# EAGLE design Circuit (EAGLE 9.6.2)
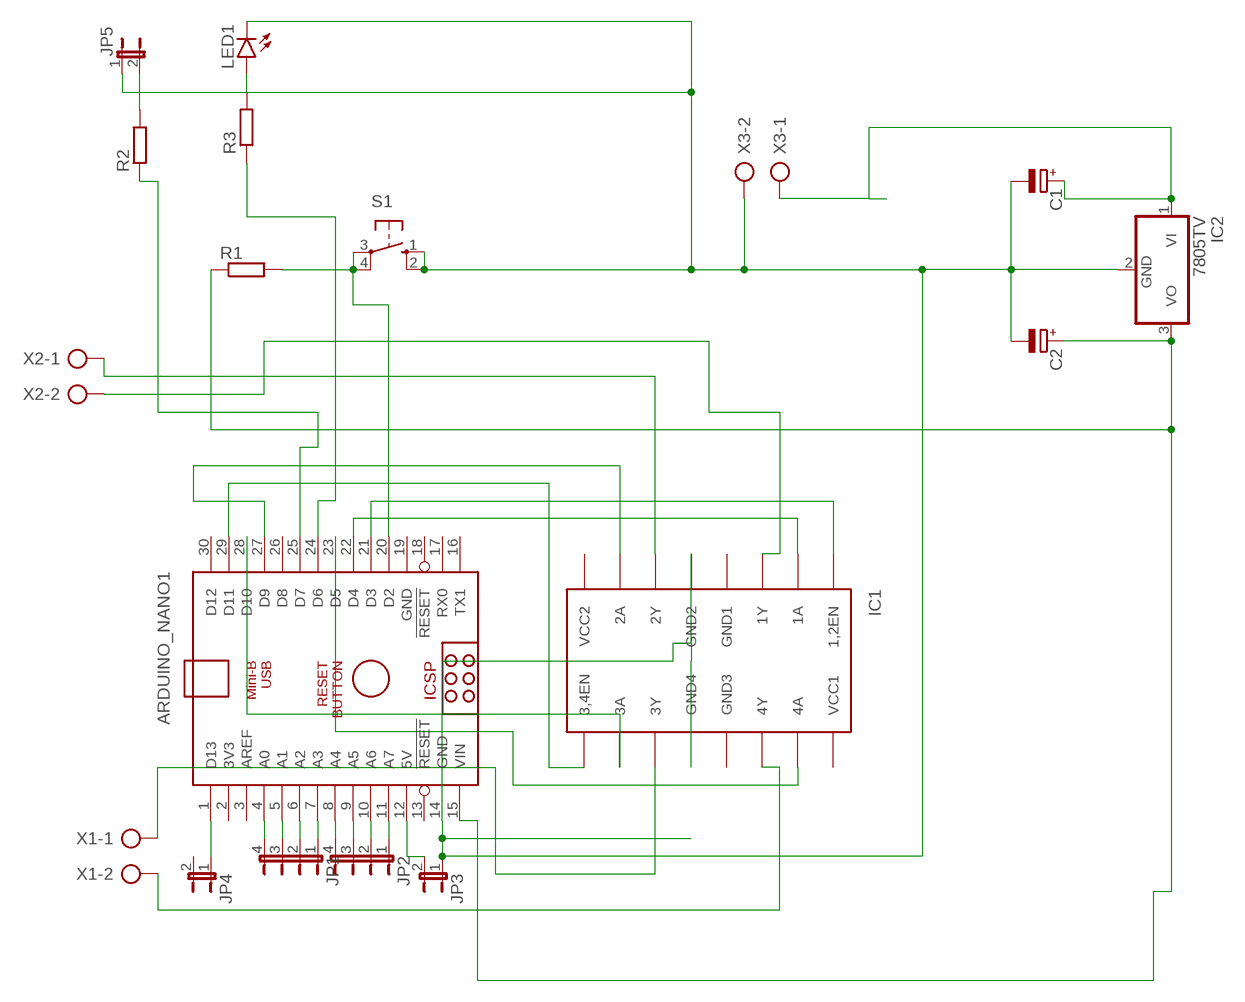
[diagram p0: schematic, sheet 1]

## Parts
ARDUINO_NANO1  ARDUINO_NANO  [ARDUINO_NANO]
C1  CPOL-EUE2.5-6  [E2,5-6]
C2  CPOL-EUE2.5-6  [E2,5-6]
IC1  L293D  [DIL16]
IC2  7805TV  [TO220V]
JP1  JP4E  [JP4]
JP2  JP4E  [JP4]
JP3  JP1E  [JP1]
JP4  JP1E  [JP1]
JP5  JP1E  [JP1]
LED1  LED5MM  [LED5MM]
R1  R-EU_0207/12  [0207/12]
R2  R-EU_0207/12  [0207/12]
R3  R-EU_0207/12  [0207/12]
S1  10-XX  [B3F-10XX]
X1  AK500/2  [AK500/2]
X2  AK500/2  [AK500/2]
X3  AK500/2  [AK500/2]

## Nets
N$1: ARDUINO_NANO1.4(A0) JP1.4
N$2: ARDUINO_NANO1.5(A1) JP1.3
N$3: ARDUINO_NANO1.6(A2) JP1.2
N$4: ARDUINO_NANO1.7(A3) JP1.1
N$5: ARDUINO_NANO1.8(A4) JP2.4
N$6: ARDUINO_NANO1.9(A5) JP2.3
N$7: ARDUINO_NANO1.10(A6) JP2.2
N$8: ARDUINO_NANO1.11(A7) JP2.1
N$9: ARDUINO_NANO1.12(5V) JP3.2
N$10: ARDUINO_NANO1.24(D6) R3.1
N$11: ARDUINO_NANO1.1(D13) JP4.1
N$12: ARDUINO_NANO1.21(D3) IC1.1(1,2EN)
N$13: ARDUINO_NANO1.22(D4) IC1.2(1A)
N$14: ARDUINO_NANO1.27(D9) IC1.7(2A)
N$15: ARDUINO_NANO1.29(D11) IC1.9(3,4EN)
N$16: ARDUINO_NANO1.23(D5) IC1.15(4A)
N$17: ARDUINO_NANO1.28(D10) IC1.10(3A)
N$18: IC1.11(3Y) X1.1
N$19: IC1.14(4Y) X1.2
N$20: IC1.6(2Y) X2.1
N$21: IC1.3(1Y) X2.2
N$22: C1.+ IC2.1(VI) X3.1
N$23: ARDUINO_NANO1.15(VIN) C2.+ IC2.3(VO) R1.1
N$24: ARDUINO_NANO1.14(GND) C1.- C2.- IC1.5(GND2) IC1.12(GND4) IC2.2(GND) JP3.1 JP5.1 LED1.K(C) S1.1(S) S1.2(S1) X3.2
N$25: ARDUINO_NANO1.20(D2) R1.2 S1.3(P) S1.4(P1)
N$26: LED1.A R3.2
N$27: ARDUINO_NANO1.25(D7) R2.1
N$28: JP5.2 R2.2
Unconnected: ARDUINO_NANO1.2(3V3) ARDUINO_NANO1.3(AREF) ARDUINO_NANO1.13(!RESET) ARDUINO_NANO1.16(TX1) ARDUINO_NANO1.17(RX0) ARDUINO_NANO1.18(!RESET) ARDUINO_NANO1.26(D8) ARDUINO_NANO1.30(D12) JP4.2

## Power pins joined to a net without a drawn wire
GND: ARDUINO_NANO1.19(GND)
GND1: IC1.4(GND1)
GND3: IC1.13(GND3)
VCC1: IC1.16(VCC1)
VCC2: IC1.8(VCC2)

## Library data of the parts
ARDUINO_NANO1 = ArduinoNanoV30:ARDUINO_NANO: Arduino Nano V3.0 Overview: The Arduino Nano is a small, complete, and breadboard-friendly board based on the ATmega328 (Arduino Nano 3.x) or ATmega168 (Arduino Nano 2.x). It has more or less the same functionality of the Arduino Duemilanove, but in a different package. It lacks only a DC power jack, and works with a Mini-B USB cable instead of a standard one. The Nano was designed and is being produced by Gravitech. Specifications: Microcontroller Atmel ATmega168 or ATmega328 Operating Voltage (logic level) 5 V Input Voltage (recommended) 7-12 V Input Voltage (limits) 6-20 V Digital I/O Pins 14 (of which 6 provide PWM output) Analog Input Pins 8 DC Current per I/O Pin 40 mA Flash Memory 16 KB (ATmega168) or 32 KB (ATmega328) of which 2 KB used by bootloader SRAM 1 KB (ATmega168) or 2 KB (ATmega328) EEPROM 512 bytes (ATmega168) or 1 KB (ATmega328) Clock Speed 16 MHz Dimensions 0.73" x 1.70" Length 45 mm Width 18 mm Weigth 5 g Power: The Arduino Nano can be powered via the Mini-B USB connection, 6-20V unregulated external power supply (pin 30), or 5V regulated external power supply (pin 27). The power source is automatically selected to the highest voltage source. Memory: The ATmega168 has 16 KB of flash memory for storing code (of which 2 KB is used for the bootloader); the ATmega328 has 32 KB, (also with 2 KB used for the bootloader). The ATmega168 has 1 KB of SRAM and 512 bytes of EEPROM (which can be read and written with the EEPROM library); the ATmega328 has 2 KB of SRAM and 1 KB of EEPROM. Input and Output: Each of the 14 digital pins on the Nano can be used as an input or output, using pinMode(), digitalWrite(), and digitalRead() functions. They operate at 5 volts. Each pin can provide or receive a maximum of 40 mA and has an internal pull-up resistor (disconnected by default) of 20-50 kOhms. In addition, some pins have specialized functions. Visit Arduino - ArduinoBoardNano <https://www.arduino.cc/en/Main/ArduinoBoardNano>
C1 C2 = rcl:CPOL-EU: POLARIZED CAPACITOR, European symbol; SPICEPREFIX: C
IC1 = sgs-thom:L293D
IC2 = linear:78*: Positive VOLTAGE REGULATOR Source: http://cache.national.com/ds/LM/LM78L05.pdf http://www.fairchildsemi.com/ds/LM/LM7805.pdf
JP1 JP2 = jumper:JP4E: JUMPER
JP3-JP5 = jumper:JP1E: JUMPER
LED1 = led:LED: LED OSRAM: - CHIPLED LG R971, LG N971, LY N971, LG Q971, LY Q971, LO R971, LY R971 LH N974, LH R974 LS Q976, LO Q976, LY Q976 LO Q996 - Hyper CHIPLED LW Q18S LB Q993, LB Q99A, LB R99A - SideLED LS A670, LO A670, LY A670, LG A670, LP A670 LB A673, LV A673, LT A673, LW A673 LH A674 LY A675 LS A676, LA A676, LO A676, LY A676, LW A676 LS A679, LY A679, LG A679 - Hyper Micro SIDELED® LS Y876, LA Y876, LO Y876, LY Y876 LT Y87S - SmartLED LW L88C, LW L88S LB L89C, LB L89S, LG L890 LS L89K, LO L89K, LY L89K LS L896, LA L896, LO L896, LY L896 - TOPLED LS T670, LO T670, LY T670, LG T670, LP T670 LSG T670, LSP T670, LSY T670, LOP T670, LYG T670 LG T671, LOG T671, LSG T671 LB T673, LV T673, LT T673, LW T673 LH T674 LS T676, LA T676, LO T676, LY T676, LB T676, LH T676, LSB T676, LW T676 LB T67C, LV T67C, LT T67C, LS T67K, LO T67K, LY T67K, LW E67C LS E67B, LA E67B, LO E67B, LY E67B, LB E67C, LV E67C, LT E67C LW T67C LS T679, LY T679, LG T679 LS T770, LO T770, LY T770, LG T770, LP T770 LB T773, LV T773, LT T773, LW T773 LH T774 LS E675, LA E675, LY E675, LS T675 LS T776, LA T776, LO T776, LY T776, LB T776 LHGB T686 LT T68C, LB T68C - Hyper Mini TOPLED® LB M676 - Mini TOPLED Santana® LG M470 LS M47K, LO M47K, LY M47K Source: http://www.osram.convergy.de LUXEON: - LUMILED® LXK2-PW12-R00, LXK2-PW12-S00, LXK2-PW14-U00, LXK2-PW14-V00 LXK2-PM12-R00, LXK2-PM12-S00, LXK2-PM14-U00 LXK2-PE12-Q00, LXK2-PE12-R00, LXK2-PE12-S00, LXK2-PE14-T00, LXK2-PE14-U00 LXK2-PB12-K00, LXK2-PB12-L00, LXK2-PB12-M00, LXK2-PB14-N00, LXK2-PB14-P00, LXK2-PB14-Q00 LXK2-PR12-L00, LXK2-PR12-M00, LXK2-PR14-Q00, LXK2-PR14-R00 LXK2-PD12-Q00, LXK2-PD12-R00, LXK2-PD12-S00 LXK2-PH12-R00, LXK2-PH12-S00 LXK2-PL12-P00, LXK2-PL12-Q00, LXK2-PL12-R00 Source: www.luxeon.com KINGBRIGHT: KA-3528ASYC Source: www.kingbright.com
R1-R3 = rcl:R-EU_: RESISTOR, European symbol; SPICEPREFIX: R
S1 = switch-omron:10-XX: OMRON SWITCH; MPN: B3F-1000; OC_FARNELL: 176432; OC_NEWARK: 36M3542
X1-X3 = con-ptr500:AK500/2: CONNECTOR; OC_FARNELL: unknown; OC_NEWARK: unknown

## Board
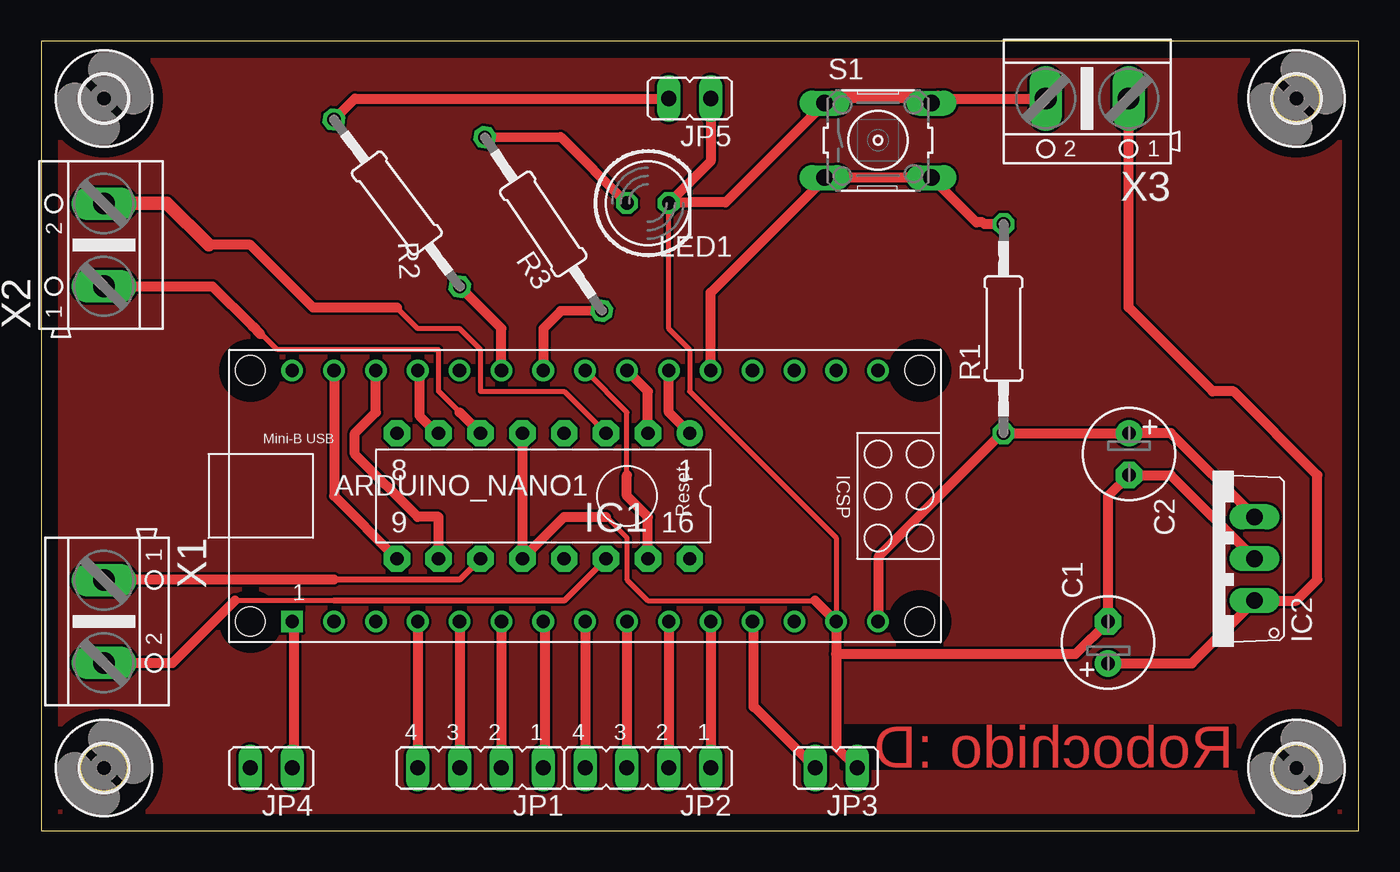
[diagram p1: board, top side]
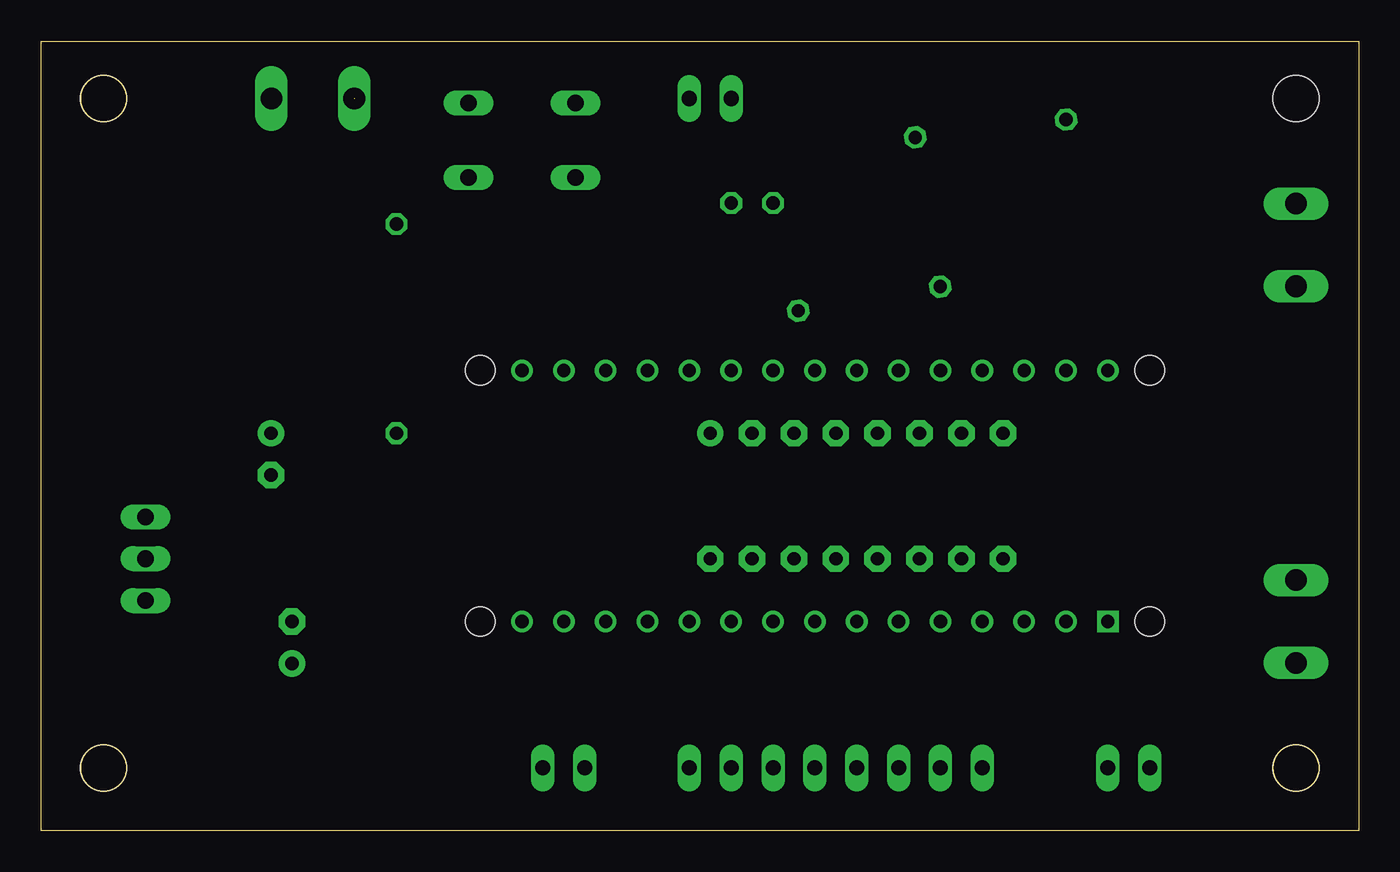
[diagram p2: board, bottom side, seen from below]

Size 79.99 x 47.93 mm. Coordinates in mm from the lower left corner, seen from the top.
Outline: 5.2,3.96 5.21,3.86 5.21,3.76 5.2,3.66 5.19,3.56 5.17,3.46 5.14,3.37 5.1,3.27 5.06,3.18 5.01,3.09 4.96,3.01 4.9,2.93 4.83,2.85 4.76,2.79 4.69,2.72 4.61,2.66 4.52,2.6 4.44,2.56 4.35,2.52 4.25,2.48 4.16,2.45 4.06,2.43 3.96,2.42 3.86,2.41 3.76,2.41 3.66,2.42 3.56,2.43 3.46,2.45 3.37,2.48 3.27,2.52 3.18,2.56 3.09,2.6 3.01,2.66 2.93,2.72 2.85,2.79 2.79,2.85 2.72,2.93 2.66,3.01 2.6,3.09 2.56,3.18 2.52,3.27 2.48,3.37 2.45,3.46 2.43,3.56 2.42,3.66 2.41,3.76 2.41,3.86 2.42,3.96 2.43,4.06 2.45,4.16 2.48,4.25 2.52,4.35 2.56,4.44 2.6,4.53 2.66,4.61 2.72,4.69 2.79,4.77 2.85,4.83 2.93,4.9 3.01,4.96 3.09,5.02 3.18,5.06 3.27,5.1 3.37,5.14 3.46,5.17 3.56,5.19 3.66,5.2 3.76,5.21 3.86,5.21 3.96,5.2 4.06,5.19 4.16,5.17 4.25,5.14 4.35,5.1 4.44,5.06 4.52,5.02 4.61,4.96 4.69,4.9 4.76,4.83 4.83,4.77 4.9,4.69 4.96,4.61 5.01,4.53 5.06,4.44 5.1,4.35 5.14,4.25 5.17,4.16 5.19,4.06 5.2,3.96
Outline: 77.59,3.96 77.6,3.86 77.6,3.76 77.59,3.66 77.58,3.56 77.56,3.46 77.53,3.37 77.49,3.27 77.45,3.18 77.41,3.09 77.35,3.01 77.29,2.93 77.22,2.85 77.16,2.79 77.08,2.72 77,2.66 76.92,2.6 76.83,2.56 76.74,2.52 76.64,2.48 76.55,2.45 76.45,2.43 76.35,2.42 76.25,2.41 76.15,2.41 76.05,2.42 75.95,2.43 75.85,2.45 75.76,2.48 75.66,2.52 75.57,2.56 75.48,2.6 75.4,2.66 75.32,2.72 75.25,2.79 75.17,2.85 75.11,2.93 75.05,3.01 75,3.09 74.95,3.18 74.91,3.27 74.87,3.37 74.84,3.46 74.82,3.56 74.81,3.66 74.8,3.76 74.8,3.86 74.81,3.96 74.82,4.06 74.84,4.16 74.87,4.25 74.91,4.35 74.95,4.44 75,4.53 75.05,4.61 75.11,4.69 75.17,4.77 75.25,4.83 75.32,4.9 75.4,4.96 75.48,5.02 75.57,5.06 75.66,5.1 75.76,5.14 75.85,5.17 75.95,5.19 76.05,5.2 76.15,5.21 76.25,5.21 76.35,5.2 76.45,5.19 76.55,5.17 76.64,5.14 76.74,5.1 76.83,5.06 76.92,5.02 77,4.96 77.08,4.9 77.16,4.83 77.22,4.77 77.29,4.69 77.35,4.61 77.41,4.53 77.45,4.44 77.49,4.35 77.53,4.25 77.56,4.16 77.58,4.06 77.59,3.96
Outline: 77.59,44.6 77.6,44.5 77.6,44.4 77.59,44.3 77.58,44.2 77.56,44.1 77.53,44.01 77.49,43.91 77.45,43.82 77.41,43.74 77.35,43.65 77.29,43.57 77.22,43.5 77.16,43.43 77.08,43.36 77,43.3 76.92,43.25 76.83,43.2 76.74,43.16 76.64,43.12 76.55,43.09 76.45,43.07 76.35,43.06 76.25,43.05 76.15,43.05 76.05,43.06 75.95,43.07 75.85,43.09 75.76,43.12 75.66,43.16 75.57,43.2 75.48,43.25 75.4,43.3 75.32,43.36 75.25,43.43 75.17,43.5 75.11,43.57 75.05,43.65 75,43.74 74.95,43.82 74.91,43.91 74.87,44.01 74.84,44.1 74.82,44.2 74.81,44.3 74.8,44.4 74.8,44.5 74.81,44.6 74.82,44.7 74.84,44.8 74.87,44.89 74.91,44.99 74.95,45.08 75,45.17 75.05,45.25 75.11,45.33 75.17,45.41 75.25,45.48 75.32,45.54 75.4,45.6 75.48,45.66 75.57,45.7 75.66,45.74 75.76,45.78 75.85,45.81 75.95,45.83 76.05,45.84 76.15,45.85 76.25,45.85 76.35,45.84 76.45,45.83 76.55,45.81 76.64,45.78 76.74,45.74 76.83,45.7 76.92,45.66 77,45.6 77.08,45.54 77.16,45.48 77.22,45.41 77.29,45.33 77.35,45.25 77.41,45.17 77.45,45.08 77.49,44.99 77.53,44.89 77.56,44.8 77.58,44.7 77.59,44.6
Outline: 0,47.93 0,0 79.99,0 79.99,47.93 0,47.93
Copper layers (1*16): Top 0.035mm / dielectric 1.5mm / Bottom 0.035mm
Design rules "default": minimum track width 6mil, minimum drill 0.35mm, track to track 6mil, track to pad 6mil, pad to pad 6mil, via to via 6mil, smd to smd 6mil, copper to edge 40mil, drill to drill 6mil, minimum pad ring 10mil, minimum via ring 8mil, stop-mask expansion 4mil, vias tented up to drill 0mil, thermal gap 10mil
Holes 2.8 mm at 3.81,44.45 3.81,3.81 76.2,44.45 76.2,3.81
Holes 1.78 mm at 12.7,12.7 12.7,27.94 53.34,27.94 53.34,12.7

### Footprints (pad centres in the part's own frame; a part is rotated, then mirrored left to right if it is on the bottom)
ARDUINO_NANO = drill 0.8 square: 1 -20.32,-7.62 | drill 0.8: 2 -17.78,-7.62; 3 -15.24,-7.62; 4 -12.7,-7.62; 5 -10.16,-7.62; 6 -7.62,-7.62; 7 -5.08,-7.62; 8 -2.54,-7.62; 9 0,-7.62; 10 2.54,-7.62; 11 5.08,-7.62; 12 7.62,-7.62; 13 10.16,-7.62; 14 12.7,-7.62; 15 15.24,-7.62; 16 15.24,7.62; 17 12.7,7.62; 18 10.16,7.62; 19 7.62,7.62; 20 5.08,7.62; 21 2.54,7.62; 22 0,7.62; 23 -2.54,7.62; 24 -5.08,7.62; 25 -7.62,7.62; 26 -10.16,7.62; 27 -12.7,7.62; 28 -15.24,7.62; 29 -17.78,7.62; 30 -20.32,7.62 | hole 1.778: -22.86,-7.62; -22.86,7.62; 17.78,7.62; 17.78,-7.62
E2,5-6 = drill 0.813 pad 1.6: + -1.27,0 | drill 0.813 pad 1.6 octagon: - 1.27,0
DIL16 = drill 0.813 pad 1.6: 1 -8.89,-3.81 | drill 0.813 pad 1.6 octagon: 2 -6.35,-3.81; 3 -3.81,-3.81; 4 -1.27,-3.81; 5 1.27,-3.81; 6 3.81,-3.81; 7 6.35,-3.81; 8 8.89,-3.81; 9 8.89,3.81; 10 6.35,3.81; 11 3.81,3.81; 12 1.27,3.81; 13 -1.27,3.81; 14 -3.81,3.81; 15 -6.35,3.81; 16 -8.89,3.81
TO220V = drill 1.016 long: 1 -2.54,-2.54; 2 0,-2.54; 3 2.54,-2.54
JP4 = drill 0.914 long: 1 -3.81,0; 2 -1.27,0; 3 1.27,0; 4 3.81,0
JP1 = drill 0.914 long: 1 0,-1.27; 2 0,1.27
LED5MM = drill 0.813 octagon: A -1.27,0; K 1.27,0
0207/12 = drill 0.813 octagon: 1 -6.35,0; 2 6.35,0
B3F-10XX = drill 1.016 long: 1 -3.251,2.261; 2 3.251,2.261; 3 -3.251,-2.261; 4 3.251,-2.261
2,8 = hole 2.8: 0,0
AK500/2 = drill 1.321 long: 1 -2.515,0; 2 2.515,0

### Placement (x,y rotation side)
ARDUINO_NANO1  35.56,20.32 0 top
C1  64.77,11.43 90 top
C2  66.04,22.86 270 top
IC1  30.48,20.32 180 top
IC2  71.12,16.51 90 top
JP1  26.67,3.81 180 top
JP2  36.83,3.81 180 top
JP3  48.26,3.81 90 top
JP4  13.97,3.81 90 top
JP5  39.37,44.45 90 top
LED1  36.83,38.1 0 top
R1  58.42,30.48 90 top
R2  21.59,38.1 127 top
R3  30.48,36.83 124 top
S1  50.8,41.91 0 top
U$1  [2,8]  3.81,44.45 0 top
U$2  [2,8]  3.81,3.81 0 top
U$3  [2,8]  76.2,44.45 0 top
U$4  [2,8]  76.2,3.81 0 top
X1  3.81,12.7 270 top
X2  3.81,35.56 90 top
X3  63.5,44.45 180 top

### Tracks (layer width: path | path; a pad name or v marks a point on that pad's centre or on a via)
N$1
  Top 0.152: 22.96,3.86 JP1.4
  Top 0.61: ARDUINO_NANO1.4 22.86,3.96 22.96,3.86
N$2
  Top 0.61: ARDUINO_NANO1.5 JP1.3
N$3
  Top 0.61: ARDUINO_NANO1.6 JP1.2
N$4
  Top 0.152: 30.58,3.86 JP1.1
  Top 0.61: ARDUINO_NANO1.7 30.58,12.6 30.58,3.86
N$5
  Top 0.61: ARDUINO_NANO1.8 JP2.4
N$6
  Top 0.61: ARDUINO_NANO1.9 JP2.3
N$7
  Top 0.61: ARDUINO_NANO1.10 JP2.2
N$8
  Top 0.61: ARDUINO_NANO1.11 JP2.1
N$9
  Top 0.152: 43.23,7.52 46.89,3.86 JP3.2
  Top 0.61: ARDUINO_NANO1.12 43.23,12.65 43.23,7.52 43.28,7.52 JP3.2
N$10
  Top 0.61: R3.1 31.54,31.54 30.48,30.48 ARDUINO_NANO1.24
N$11
  Top 0.152: 15.34,3.86 JP4.1
  Top 0.61: ARDUINO_NANO1.1 15.34,12.6 15.34,3.86
N$12
  Top 0.152: 38.2,27.94 ARDUINO_NANO1.21 | 39.27,24.13 IC1.1
  Top 0.61: IC1.1 38.1,25.4 ARDUINO_NANO1.21
N$13
  Top 0.152: 35.61,27.94 ARDUINO_NANO1.22
  Top 0.61: ARDUINO_NANO1.22 36.83,26.67 IC1.2
N$14
  Top 0.152: 24.03,24.13 IC1.7
  Top 0.61: ARDUINO_NANO1.27 22.96,27.84 22.96,25.2 24.03,24.13
N$15
  Top 0.61: ARDUINO_NANO1.29 17.78,20.32 IC1.9
N$16
  Top 0.305: ARDUINO_NANO1.23 35.56,25.4 35.56,21.59
  Top 0.61: IC1.15 36.83,19.05 35.56,20.32 35.56,21.59
N$17
  Top 0.152: 24.03,16.51 IC1.10
  Top 0.61: 20.33,27.93 ARDUINO_NANO1.28 20.32,25.4 19.05,24.13 19.05,22.86 22.86,19.05 24.13,19.05 IC1.10
N$18
  Top 0.356: IC1.11 25.4,15.24 17.78,15.24
  Top 0.61: X1.1 3.83,15.24 17.78,15.24
N$19
  Top 0.152: 3.81,10.26 X1.2
  Top 0.305: 17.78,13.97 11.76,13.97
  Top 0.356: IC1.14 31.75,13.97 17.78,13.97
  Top 0.61: X1.2 7.98,10.18 11.76,13.97
N$20
  Top 0.305: 25.4,25.4 24.13,26.67 24.13,29.21 14.34,29.21 13.55,30 13.44,30 12.83,30.61
  Top 0.61: X2.1 10.4,33.05 12.83,30.61 13.29,30.15 | IC1.6 25.4,25.4
  Bottom 0.152: 3.91,33.02 X2.1
N$21
  Top 0.305: IC1.3 31.75,26.67 26.67,26.67 26.67,29.21 25.4,30.48 22.86,30.48 21.59,31.75
  Top 0.61: 10.16,35.56 12.7,35.56 16.51,31.75 21.59,31.75
  Top 0.813: 10.16,35.56 7.62,38.1 3.83,38.1 X2.2
  Bottom 0.152: 3.91,38.05 X2.2
N$22
  Top 0.152: 72.39,13.97 IC2.1
  Top 0.61: C1.+ 69.85,10.16 IC2.1 76.2,13.97 77.47,15.24 77.47,21.59 72.39,26.67 71.12,26.67 66.02,31.77 X3.1
  Bottom 0.152: 66.09,44.4 X3.1 | 73.66,14.07 IC2.1
N$23
  Top 0.152: 58.32,24.13 R1.1
  Top 0.61: ARDUINO_NANO1.15 50.85,12.75 50.85,16.66 58.32,24.13 58.47,24.13 | R1.1 C2.+ 68.58,24.13 IC2.3
N$24  (1 unrouted)
  Top 0.152: 48.26,5.08 48.26,10.72 ARDUINO_NANO1.14 | 64.87,12.7 C1.- | 39.37,38.15 38.2,38.15 LED1.K | 41.55,38.15 41.71,38.3 | 54.05,44.25 47.65,44.25 S1.1 | 54.05,44.25 54.43,44.63 | 54.05,44.25 S1.2
  Top 0.305: 34.29,19.05 35.56,17.78 35.56,15.24 36.83,13.97 46.99,13.97 | LED1.K 38.1,30.48 39.37,29.21 39.37,26.67 48.26,17.78 ARDUINO_NANO1.14
  Top 0.61: 41.55,38.15 39.37,38.15 38.15,38.15 LED1.K 40.64,40.64 JP5.1 | 41.71,38.3 47.55,44.15 S1.1 48.01,44.63 54.43,44.63 | JP3.1 48.26,5.08 ARDUINO_NANO1.14 46.99,13.97 | 48.26,10.72 62.79,10.72 C1.- 64.77,20.32 C2.- 68.58,21.59 IC2.2 | X3.2 60.96,44.48 | IC1.5 IC1.12 31.75,19.05 34.29,19.05 | S1.2 54.33,44.45 60.96,44.45
N$25
  Top 0.152: 47.17,39.19 47.5,39.52 S1.3 | 53.34,39.68 54.05,39.68 S1.4
  Top 0.61: ARDUINO_NANO1.20 40.64,32.66 47.17,39.19 | S1.3 47.57,39.68 53.34,39.68 | S1.4 56.77,36.93 57.15,36.93 57.25,36.83 R1.2
N$26
  Top 0.61: 35.56,38.45 LED1.A 31.54,42.12 R3.2
N$27
  Top 0.61: R2.1 27.94,30.5 ARDUINO_NANO1.25
N$28
  Top 0.61: R2.2 19.05,44.45 JP5.2
N$29
  pour Top: 0,46.99 0,0 80.01,0 80.01,48.26 0,48.26

### Text on the board
Top: Robochido :D